# Altium schematic sheet Digital_Input3.SchDoc
size A4; SheetNumber: 4; SheetTotal: 16
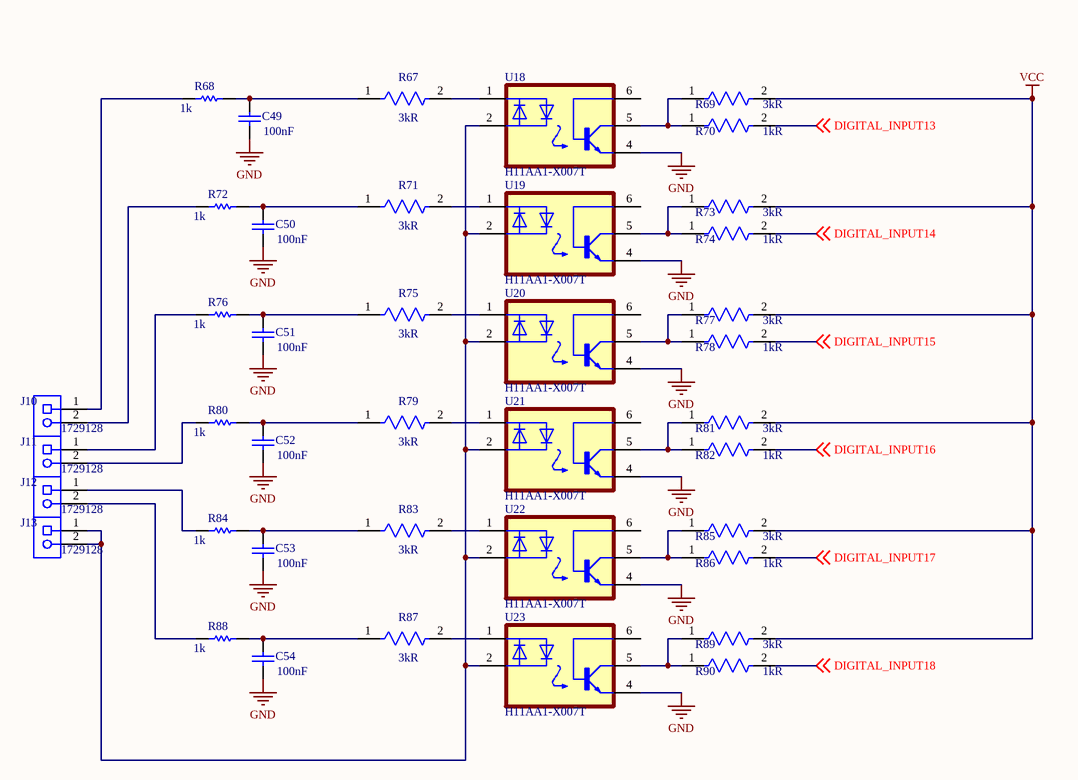
[diagram p0: Digital_Input3.SchDoc]

## Parts
C49  value 100nF  [CAPC1608X87X35NL15T15]  (hidden comment: C0603T104K3RACTU)
C50  value 100nF  [CAPC1608X87X35NL15T15]  (hidden comment: C0603T104K3RACTU)
C51  value 100nF  [CAPC1608X87X35NL15T15]  (hidden comment: C0603T104K3RACTU)
C52  value 100nF  [CAPC1608X87X35NL15T15]  (hidden comment: C0603T104K3RACTU)
C53  value 100nF  [CAPC1608X87X35NL15T15]  (hidden comment: C0603T104K3RACTU)
C54  value 100nF  [CAPC1608X87X35NL15T15]  (hidden comment: C0603T104K3RACTU)
J10  1729128  [PHOE-1729128-2_V]
J11  1729128  [PHOE-1729128-2_V]
J12  1729128  [PHOE-1729128-2_V]
J13  1729128  [PHOE-1729128-2_V]
R67  Resistance: 3kR  [FP-CRCW0603-e3-IPC_A]  (hidden comment: CRCW06033K00FKEA)
R68  value 1k  [RESC1608X55X25LL10T15]  (hidden comment: RT0603DRE071KL)
R69  Resistance: 3kR  [FP-CRCW0603-e3-IPC_A]  (hidden comment: CRCW06033K00FKEA)
R70  Resistance: 1kR  [FP-RC0603-0_55-IPC_C]  (hidden comment: RC0603FR-071KL)
R71  Resistance: 3kR  [FP-CRCW0603-e3-IPC_A]  (hidden comment: CRCW06033K00FKEA)
R72  value 1k  [RESC1608X55X25LL10T15]  (hidden comment: RT0603DRE071KL)
R73  Resistance: 3kR  [FP-CRCW0603-e3-IPC_A]  (hidden comment: CRCW06033K00FKEA)
R74  Resistance: 1kR  [FP-RC0603-0_55-IPC_C]  (hidden comment: RC0603FR-071KL)
R75  Resistance: 3kR  [FP-CRCW0603-e3-IPC_A]  (hidden comment: CRCW06033K00FKEA)
R76  value 1k  [RESC1608X55X25LL10T15]  (hidden comment: RT0603DRE071KL)
R77  Resistance: 3kR  [FP-CRCW0603-e3-IPC_A]  (hidden comment: CRCW06033K00FKEA)
R78  Resistance: 1kR  [FP-RC0603-0_55-IPC_C]  (hidden comment: RC0603FR-071KL)
R79  Resistance: 3kR  [FP-CRCW0603-e3-IPC_A]  (hidden comment: CRCW06033K00FKEA)
R80  value 1k  [RESC1608X55X25LL10T15]  (hidden comment: RT0603DRE071KL)
R81  Resistance: 3kR  [FP-CRCW0603-e3-IPC_A]  (hidden comment: CRCW06033K00FKEA)
R82  Resistance: 1kR  [FP-RC0603-0_55-IPC_C]  (hidden comment: RC0603FR-071KL)
R83  Resistance: 3kR  [FP-CRCW0603-e3-IPC_A]  (hidden comment: CRCW06033K00FKEA)
R84  value 1k  [RESC1608X55X25LL10T15]  (hidden comment: RT0603DRE071KL)
R85  Resistance: 3kR  [FP-CRCW0603-e3-IPC_A]  (hidden comment: CRCW06033K00FKEA)
R86  Resistance: 1kR  [FP-RC0603-0_55-IPC_C]  (hidden comment: RC0603FR-071KL)
R87  Resistance: 3kR  [FP-CRCW0603-e3-IPC_A]  (hidden comment: CRCW06033K00FKEA)
R88  value 1k  [RESC1608X55X25LL10T15]  (hidden comment: RT0603DRE071KL)
R89  Resistance: 3kR  [FP-CRCW0603-e3-IPC_A]  (hidden comment: CRCW06033K00FKEA)
R90  Resistance: 1kR  [FP-RC0603-0_55-IPC_C]  (hidden comment: RC0603FR-071KL)
U18  H11AA1-X007T  [SOIC254P1030X460-6N]
U19  H11AA1-X007T  [SOIC254P1030X460-6N]
U20  H11AA1-X007T  [SOIC254P1030X460-6N]
U21  H11AA1-X007T  [SOIC254P1030X460-6N]
U22  H11AA1-X007T  [SOIC254P1030X460-6N]
U23  H11AA1-X007T  [SOIC254P1030X460-6N]

## Nets
GND: C49.1 C50.1 C51.1 C52.1 C53.1 C54.1 U18.4(E) U19.4(E) U20.4(E) U21.4(E) U22.4(E) U23.4(E)
VCC: R69.2 R73.2 R77.2 R81.2 R85.2 R89.2
DIGITAL_INPUT13: R70.2 ; off-sheet DIGITAL_INPUT13
DIGITAL_INPUT14: R74.2 ; off-sheet DIGITAL_INPUT14
DIGITAL_INPUT15: R78.2 ; off-sheet DIGITAL_INPUT15
DIGITAL_INPUT16: R82.2 ; off-sheet DIGITAL_INPUT16
DIGITAL_INPUT17: R86.2 ; off-sheet DIGITAL_INPUT17
DIGITAL_INPUT18: R90.2 ; off-sheet DIGITAL_INPUT18
NetC49_2: C49.2 R67.1 R68.2
NetC50_2: C50.2 R71.1 R72.2
NetC51_2: C51.2 R75.1 R76.2
NetC52_2: C52.2 R79.1 R80.2
NetC53_2: C53.2 R83.1 R84.2
NetC54_2: C54.2 R87.1 R88.2
NetJ10_1: J10.1 R68.1
NetJ10_2: J10.2 R72.1
NetJ11_1: J11.1 R76.1
NetJ11_2: J11.2 R80.1
NetJ12_1: J12.1 R84.1
NetJ12_2: J12.2 R88.1
NetJ13_1: J13.1 J13.2 U18.2(C/A) U19.2(C/A) U20.2(C/A) U21.2(C/A) U22.2(C/A) U23.2(C/A)
NetR67_2: R67.2 U18.1(A/C)
NetR69_1: R69.1 R70.1 U18.5(C)
NetR71_2: R71.2 U19.1(A/C)
NetR73_1: R73.1 R74.1 U19.5(C)
NetR75_2: R75.2 U20.1(A/C)
NetR77_1: R77.1 R78.1 U20.5(C)
NetR79_2: R79.2 U21.1(A/C)
NetR81_1: R81.1 R82.1 U21.5(C)
NetR83_2: R83.2 U22.1(A/C)
NetR85_1: R85.1 R86.1 U22.5(C)
NetR87_2: R87.2 U23.1(A/C)
NetR89_1: R89.1 R90.1 U23.5(C)

Not connected (* = marked no-connect by the designer): U18 6(B); U19 6(B); U20 6(B); U21 6(B); U22 6(B); U23 6(B)

## Library data of the parts
C49-C54 = CMP-2006-03843-1: Manufacturer: Kemet; Part Number: C0603T104K3RACTU
J10-J13 = CMP-2000-05815-1: PCB Terminal Block, 13.5 A, 400 V, 2-Pin THD, RoHS, Bulk; Manufacturer: Phoenix Contact; Package Version: 03/2015; No. of Rows: 1; Pitch: 5.08mm; No. of Positions: 2; Voltage Rating: 400V; Current Rating: 13500mA; Manufacturer URL: http://www.phoenixcontact.com/; Datasheet URL: https://datasheet.ciiva.com/16046/1729128-16046181.pdf; RoHS: TRUE; Package URL: https://www.phoenixcontact.com/online/portal/pi/pxc/product_detail_page/!ut/p/b1/3VdJjqNKFDxLH8AFycySyWY2ozFsEPOMMQaDOX1XedGL_1Vdm5YXJleknhSKeBkvI6EA8ncAo3AYoDhBQGco6KN7VURTdemj9us_IEKEZo_YHiPAEWEFmDGOHMORkqKYCORBZxgL7ZoaZYcbFFUZ3fqxSY6GOuxydWUuHqz1ynmMFygu583Bob0Ewr6Sd_l-5m-kAueHiB0jpRwZwe58wwtkpxtMYd_LmGcDRU02dRNEyWt6Y2ti5pSyJ_reIkzIulrqApdnbT11V5jnCKbYNCvhEM1MCpPByat_X379-iThf08CI5GfOPqfBeS3BRoBOdD55AKVv0iLwCMq-2BrzXWSGRH7pUGD9uwXQjiph3xL0DKQwdGa0JImiIOmBNOestqgwTHSSs2oOep-78apyXQBvNi8ZLaFjvjWvcaUEBu0MC6Wbe-d6mB0FAebo2lUWinqYaZs5DAYzV0RP9yitUjnGJ0iI9xhZkT42OCQNUJJhkgWINNQLP2JFP6OpMg3JCVg70jqHT0lvKOnhHf0lPuOnnLf0VPuWx6_dxwUIvwk5WMkT0kLL1mh61l2yZVSzG3pYV_bqo-mj6uMKwKwdnnW8Jh5RTOJzMOA5c-eJDaZQw4mTMPH02PvS_ZAqNVjVTo2WyYLkwH_KU1mmmG5kjRhDqPXLwwVHvVOjCM60-fpXvTDfMGW1PVFVS1r4e4yVDk4ZdNbkUHvqPqQSeian4UD39fNKmachqdJ1NJbyk8rXT9mXTvPk3oE5meulKGgiruPJek-4I9hTT6G8ZLOyRSm2RRVbThERQad5OS28hdt4YW4vG0stgYYzsWsK4_7y6DZMjJSCqri1kyiZR5vD7pwIrNR7QwPHTcLTI5qT7eRlpHrdGiupYlqQDJ7zy_CND8fWWBoLRXxk1RVcXiBQwbTD4Xi7KL-FuO94t9xaqweXzH; PartNumber: 1729128; Package Description: 2-Pin Through Hole Device, Body 8.1 x 10.16 mm, Pitch 5.08 mm; Datasheet Version: 12/2013; Mounting Technology: ThroughHole; Orientation: Horizontal; Package Reference: 1729128-2; Packing: Bulk
R67 R69 R71 R73 R75 R77 R79 R81 R83 R85 R87 R89 = CMP-2000-03293-2: RES Thick Film, 3kΩ, 1%, 0.1W, 100ppm/°C, 0603; Voltage Rating: 75V; Power Rating: 100mW; Features: Automotive AEC-Q200; Radiation Hardening: No; Contact Plating: Tin; Termination: SMD/SMT; Lead Free: Lead Free; Case Code (Imperial): 0603; Case Code (Metric): 1608; Case/Package: 0603; Depth: 0.85mm; Mount: Surface Mount; Voltage Rating (DC): 75V; Tolerance: 1%; Package Quantity: 10; Temperature Coefficient: 100ppm/°C; Height: 0.45mm; Max Power Dissipation: 100mW; Composition: Thick Film; Max Operating Temperature: 155°C; Military Standard: Not; Weight: 7.1E-05oz; Length: 1.55mm; Packaging: Tape and Reel; Number of Terminations: 2; Width: 0.85mm; Min Operating Temperature: -55°C
R68 R72 R76 R80 R84 R88 = CMP-2000-04615-1: Manufacturer: Yageo; Part Number: RT0603DRE071KL
R70 R74 R78 R82 R86 R90 = CMP-1659-00009-5: RES 1K OHM 1% 1/10W 0603; Voltage Rating: 50V; Power Rating: 100mW; Temperature Coefficient: 100ppm/°C; Military Standard: Not; REACH SVHC: No SVHC; Size Code: 0603; Features: Moisture Resistant; Number of Terminations: 2; Technology: THICK FILM; Series: RC; Case Code (Metric): 1608; Resistance Tolerance: 1%; Resistor Type: Thick Film; Termination: SMD/SMT; Contact Plating: Tin; Radiation Hardening: No; Min Operating Temperature: -55°C; Max Operating Temperature: 155°C; Packaging: Tape and Reel; Max Power Dissipation: 100mW; RoHS Compliant: Yes; Height: 0.45mm; Lead Free: Lead Free; Case/Package: 0603; Length: 1.6mm; Tolerance: 1%; Case Code (Imperial): 0603; Construction: Rectangular; Depth: 0.8mm
U18-U23 = H11AA1-X007T: H11AA1 Series Single Channel 30V 5300 Vrms SMT Phototransistor Optocoupler DIP-6; MF: Vishay Semiconductor; SnapEDA_Link: https://www.snapeda.com/parts/H11AA1-X007T/Vishay/view-part/?ref=snap; Package: SMD-6 Vishay; Value: *; MP: H11AA1-X007T; Check_prices: https://www.snapeda.com/parts/H11AA1-X007T/Vishay/view-part/?ref=eda